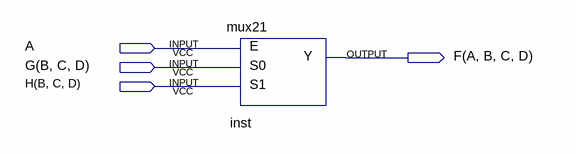
[diagram p0: schematic sheet]
// Quartus schematic hw3q5.bdf as structural Verilog: 1 symbols, 4 pins
module hw3q5 (
  input  A,
  input  \G(B ,
  inout  C,
  inout  \D) ,
  input  \H(B ,
  output \F(A ,
  output B
);

  mux21 inst (.E(A), .S0({\G(B , C, \D) }), .S1({\H(B , C, \D) }), .Y({\F(A , B, C, \D) }));
endmodule
